# Altium schematic sheet Wifi_Module.SchDoc
size A4; Date: 07.08.2025; CheckedBy: Own Check; CompanyName: No Company; DocumentNumber: ELK.PCB.0005.0005.A.A; Revision: V0.0.1; SheetNumber: 7; SheetTotal: 22
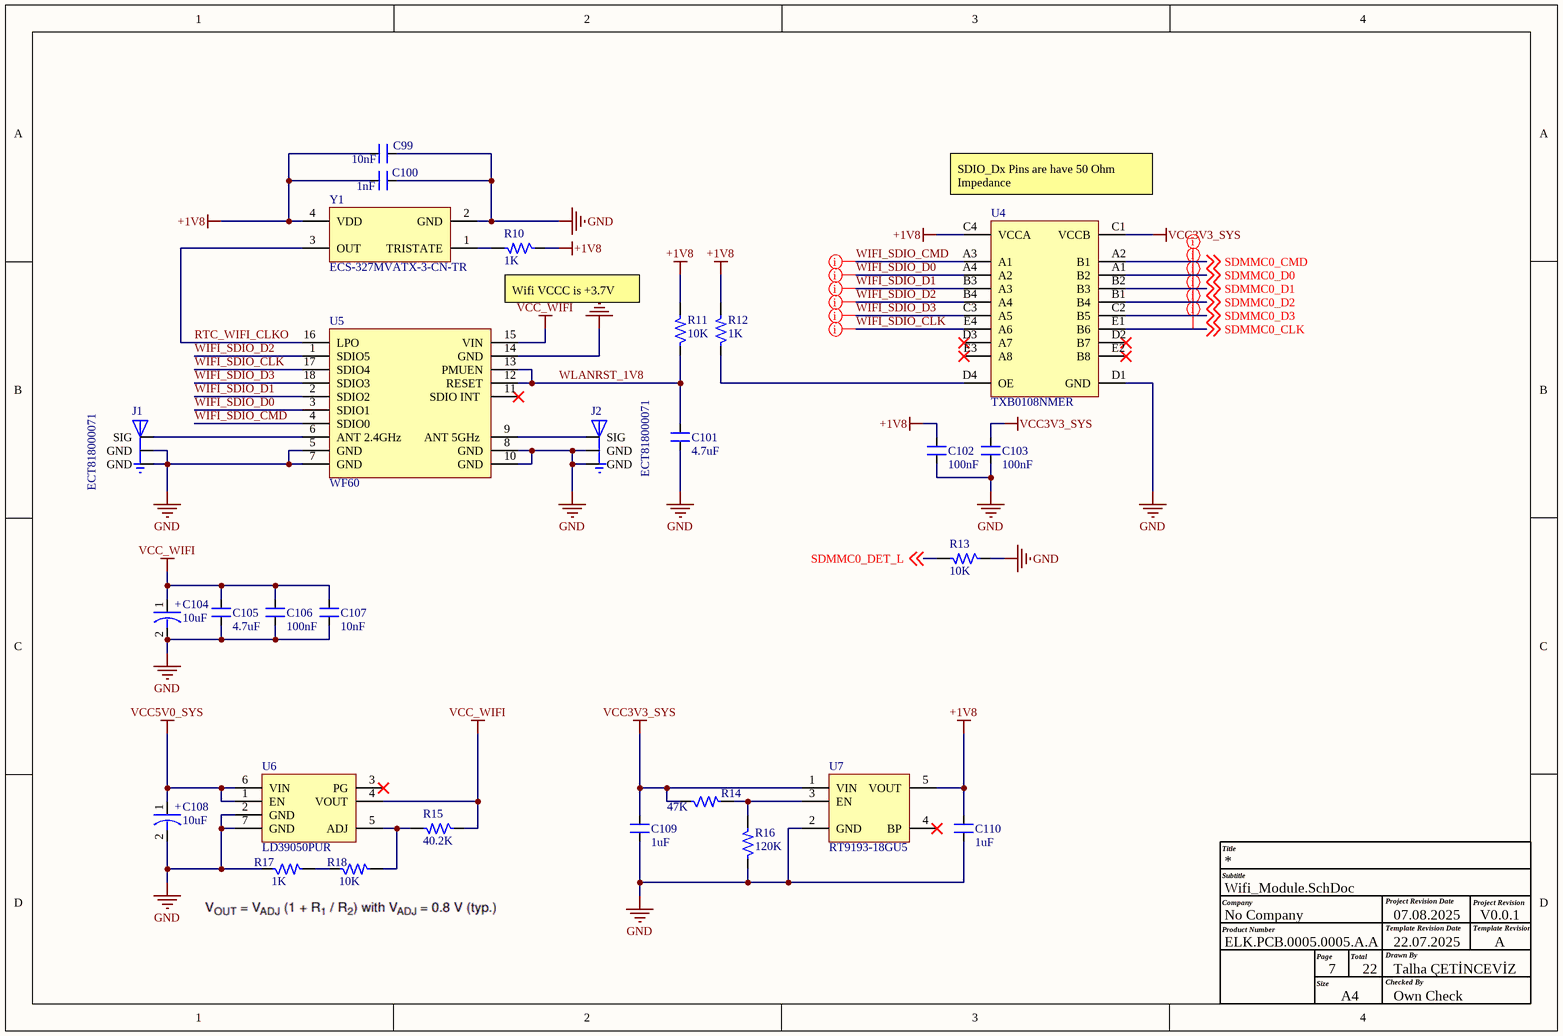
[diagram p0: Wifi_Module.SchDoc]

## Parts
C99  10nF  [CAP_0402]
C100  1nF  [CAP_0402]
C101  4.7uF  [CAP_0402]
C102  100nF  [CAP_0201]
C103  100nF  [CAP_0201]
C104  10uF  [CAP-T_1206]
C105  4.7uF  [CAP_0402]
C106  100nF  [CAP_0201]
C107  10nF  [CAP_0402]
C108  10uF  [CAP-T_1206]
C109  1uF  [CAP_0201]
C110  1uF  [CAP_0201]
J1  ECT818000071  [CON3_UFL_116_SMD_ST]
J2  ECT818000071  [CON3_UFL_116_SMD_ST]
R10  1K  [RES_0402]
R11  10K  [RES_0201]
R12  1K  [RES_0402]
R13  10K  [RES_0201]
R14  47K  [RES_0402]
R15  40.2K  [RES_0201]
R16  120K  [RES_0402]
R17  1K  [RES_0201]
R18  10K  [RES_0201]
U4  TXB0108NMER  [NFBGA_31.4_125.9X102.36]
U5  WF60  [MOD_WF60]
U6  LD39050PUR  [DFN-6_37.4_165_33X15_SMD]
U7  RT9193-18GU5  [SC70-5]
Y1  ECS-327MVATX-3-CN-TR  [XTAL_57_35X31_SMD]

## Nets
+1V8: C99.1 C100.1 C102.1 C110.2 R10.1 R11.2 R12.2 U4.C4(VCCA) U7.5(VOUT) Y1.4(VDD)
GND: C99.2 C100.2 C101.1 C102.2 C103.2 C104.2 C105.1 C106.1 C107.1 C108.2 C109.1 C110.1 J1.1(GND) J1.3(GND) J2.1(GND) J2.3(GND) R13.1 R16.1 R17.1 U4.D1(GND) U5.5(GND) U5.7(GND) U5.8(GND) U5.10(GND) U5.14(GND) U6.2(GND) U6.7(GND) U7.2(GND) Y1.2(GND)
VCC3V3_SYS: C103.1 C109.2 R14.1 U4.C1(VCCB) U7.1(VIN)
VCC5V0_SYS: C108.1 U6.1(EN) U6.6(VIN)
VCC_WIFI: C104.1 C105.2 C106.2 C107.2 R15.1 U5.15(VIN) U6.4(VOUT)
RTC_WIFI_CLKO: U5.16(LPO) Y1.3(OUT)
SDMMC0_CLK: U4.E1(B6) ; off-sheet SDMMC0_CLK
SDMMC0_CMD: U4.A2(B1) ; off-sheet SDMMC0_CMD
SDMMC0_D0: U4.A1(B2) ; off-sheet SDMMC0_D0
SDMMC0_D1: U4.B2(B3) ; off-sheet SDMMC0_D1
SDMMC0_D2: U4.B1(B4) ; off-sheet SDMMC0_D2
SDMMC0_D3: U4.C2(B5) ; off-sheet SDMMC0_D3
SDMMC0_DET_L: R13.2 ; off-sheet SDMMC0_DET_L
WIFI_SDIO_CLK: U4.E4(A6) U5.17(SDIO4)
WIFI_SDIO_CMD: U4.A3(A1) U5.4(SDIO0)
WIFI_SDIO_D0: U4.A4(A2) U5.3(SDIO1)
WIFI_SDIO_D1: U4.B3(A3) U5.2(SDIO2)
WIFI_SDIO_D2: U4.B4(A4) U5.1(SDIO5)
WIFI_SDIO_D3: U4.C3(A5) U5.18(SDIO3)
WLANRST_1V8: C101.2 R11.1 U5.12(RESET) U5.13(PMUEN)
NetJ1_2: J1.2(SIG) U5.6(ANT_2.4GHz)
NetJ2_2: J2.2(SIG) U5.9(ANT_5GHz)
NetR10_2: R10.2 Y1.1(TRISTATE)
NetR12_1: R12.1 U4.D4(OE)
NetR14_2: R14.2 R16.2 U7.3(EN)
NetR15_2: R15.2 R18.2 U6.5(ADJ)
NetR17_2: R17.2 R18.1

Not connected (* = marked no-connect by the designer): U4 D2(B7)* D3(A7)* E2(B8)* E3(A8)*; U5 11(SDIO_INT_)*; U6 3(PG)*; U7 4(BP)*

## Layout directives
net class 50OHM_SDMMC: WIFI_SDIO_CLK, WIFI_SDIO_CMD, WIFI_SDIO_D0, WIFI_SDIO_D1, WIFI_SDIO_D2, WIFI_SDIO_D3
net class 50Ohm_SDMMC: SDMMC0_CLK, SDMMC0_CMD, SDMMC0_D0, SDMMC0_D1, SDMMC0_D2, SDMMC0_D3

## Notes on the sheet
- (near U4) SDIO_Dx Pins are have 50 Ohm Impedance
- Wifi VCCC is +3.7V
- Title
- Company
- Product Number
- Subtitle
- Project Revision Date
- Template Revision Date
- Project Revision
- Template Revision
- Size
- Page
- A4
- Total
- Checked By
- Drawn By
- 22.07.2025
- Talha ÇETİNCEVİZ
- A
- (in symbol CAP-P_10uF-16V-10%-1206) +

## Library data of the parts
C99 C107 = CAP_10nF-10V-10%-0402: 10000pF ±10% 10V Ceramic Capacitor X7R 0402 (1005 Metric); Manufacturer: AVX Corporation; Manufacturer Part Number: 0402ZC103KAT2A; Case/Package: 0402; Supplier-1: Digikey
C100 = CAP_1nF-16V-10%-0402: 1000pF ±10% 16V Ceramic Capacitor X7R 0402 (1005 Metric); Manufacturer: Yageo; Manufacturer Part Number: CC0402KRX7R7BB102; Case/Package: 0402; Supplier-1: Digikey
C101 C105 = CAP_4.7uF-10V-10%-0402: 4.7µF ±10% 10V Ceramic Capacitor X5R 0402 (1005 Metric); Manufacturer: Samsung Electro-Mechanics; Manufacturer Part Number: CL05A475KP5NRNC; Case/Package: 0402; Supplier-1: Digikey
C102 C103 C106 = CAP_100nF-25V-10%-0201: 0.1µF ±10% 25V Ceramic Capacitor X5R 0201 (0603 Metric); Manufacturer: TDK Corporation; Manufacturer Part Number: C0603X5R1E104K030BB; Case/Package: 0201; Supplier-1: Digikey
C104 C108 = CAP-P_10uF-16V-10%-1206: 10µF Molded Tantalum Capacitors 16V 1206 (3216 Metric) 3Ohm; Manufacturer: AVX Corporation; Manufacturer Part Number: TAJA106K016SNJ; Alternate Part Number-1: CA45-A016K106T; Case/Package: 1206; Supplier-1: SIRICOM; Supplier Part Number-1: TAJA106K016SNJ; Category: Capacitor; Number of Pins: 2
C109 C110 = CAP_1uF-16V-10%-0201: 1µF ±20% 16V Ceramic Capacitor X5R 0201 (0603 Metric); Manufacturer: Samsung Electro-Mechanics; Manufacturer Part Number: CL03A105MO3NRNH; Case/Package: 0201; Supplier-1: Digikey
J1 J2 = CON-PLG_3X1-ECT818000071-ST-SMD: SMD RF Connectors/Coaxial Connectors RoHS; Manufacturer: ECT; Manufacturer Part Number: ECT818000071; Case/Package: SMD; Supplier-1: LCSC
R10 R12 = RES_1K-0.1W-1%-0402: 1 kOhms ±1% 0.1W, 1/10W Chip Resistor 0402 (1005 Metric) Anti-Sulfur Thin Film; Manufacturer: Vishay Beyschlag/Draloric/BC Components; Manufacturer Part Number: MCS04020C1001FE000; Case/Package: 0402; Supplier-1: Digikey
R11 R13 R18 = RES_10K-0.05W-1%-0201: 10 kOhms ±1% 0.05W, 1/20W Chip Resistor 0201 (0603 Metric) Thick Film; Manufacturer: Stackpole Electronics Inc; Manufacturer Part Number: RMCF0201FT10K0; Case/Package: 0201; Supplier-1: Digikey
R14 = RES_47K-0.1W-1%-0402: 47 kOhms ±1% 0.1W, 1/10W Chip Resistor 0402 (1005 Metric) Automotive AEC-Q200 Thick Film; Manufacturer: Panasonic Electronic Components; Manufacturer Part Number: ERJ-2RKF4702X; Case/Package: 0402; Supplier-1: Digikey
R15 = RES_40.2K-0.05W-1%-0201: 40.2 kOhms ±1% 0.05W, 1/20W Chip Resistor 0201 (0603 Metric) Automotive AEC-Q200, Moisture Resistant Thick Film; Manufacturer: Yageo; Manufacturer Part Number: AC0201FR-0740K2L; Case/Package: 0201; Supplier-1: Digikey
R16 = RES_120K-0.1W-1%-0402: 120 kOhms ±1% 0.1W, 1/10W Chip Resistor 0402 (1005 Metric) Anti-Sulfur Thin Film; Manufacturer: Vishay Beyschlag/Draloric/BC Components; Manufacturer Part Number: MCS04020C1203FE000; Case/Package: 0402; Supplier-1: Digikey
R17 = RES_1K-0.05W-1%-0201: 1 kOhms ±1% 0.05W, 1/20W Chip Resistor 0201 (0603 Metric) Thick Film; Manufacturer: Yageo; Manufacturer Part Number: RC0201FR-071KL; Case/Package: 0201; Supplier-1: Digikey
U4 = IC_TXB0108NMER: Translation - Voltage Levels 8-Bit Bidirectional Voltage-Level Shifter with Auto Direction Sensing and +/-15-kV ESD Protect; Manufacturer: Texas Instruments; Manufacturer Part Number: TXB0108NMER; Case/Package: NFBGA-20; Supplier-1: Mouser
U5 = MOD_WF60-SMD: Amp’ed RF Tech presents the WF60 WiFi dual / band module: 802.11abgn.; Alternate Part Number-1: NA; Manufacturer: Amp’ed; Manufacturer Part Number: WF60; Case/Package: SMD; Supplier-1: Arrow; Supplier Part Number-1: WF60; Category: Module; Number of Pins: 16
U6 = REG_5.5V-0~5.1V-0.5A-2.55W-DFN-6: Adjustable 5.5V 0.8V 500mA DFN-6 Linear Voltage Regulators RoHS; Manufacturer: STMicroelectronics; Alternate Part Number-1: NA; Manufacturer Part Number: LD39050PUR; Case/Package: DFN-6; Supplier-1: LCSC; Supplier Part Number-1: C222094; Category: Regulators; Number of Pins: 6
U7 = REG_1.8V-300mA-5.5V-SC70-5: Linear Voltage Regulator IC 1 Output 300mA SC-70-5; Manufacturer: Richtek USA Inc.; Manufacturer Part Number: RT9193-18GU5; Case/Package: SC70-5; Supplier-1: Digikey
Y1 = XTAL_ECS-327MVATX-2-CN-TR: 32.768kHz XO (Standard) CMOS Oscillator 1.6V ~ 3.6V Enable/Disable 4-SMD, No Lead; Manufacturer: ECS INC; Alternate Part Number-1: NA; Manufacturer Part Number: ECS-327MVATX-3-CN-TR; Case/Package: SMD-4; Supplier-1: Digikey; Supplier Part Number-1: ECS-327MVATX-3-CN-TR; Category: Crystal; Number of Pins: 4